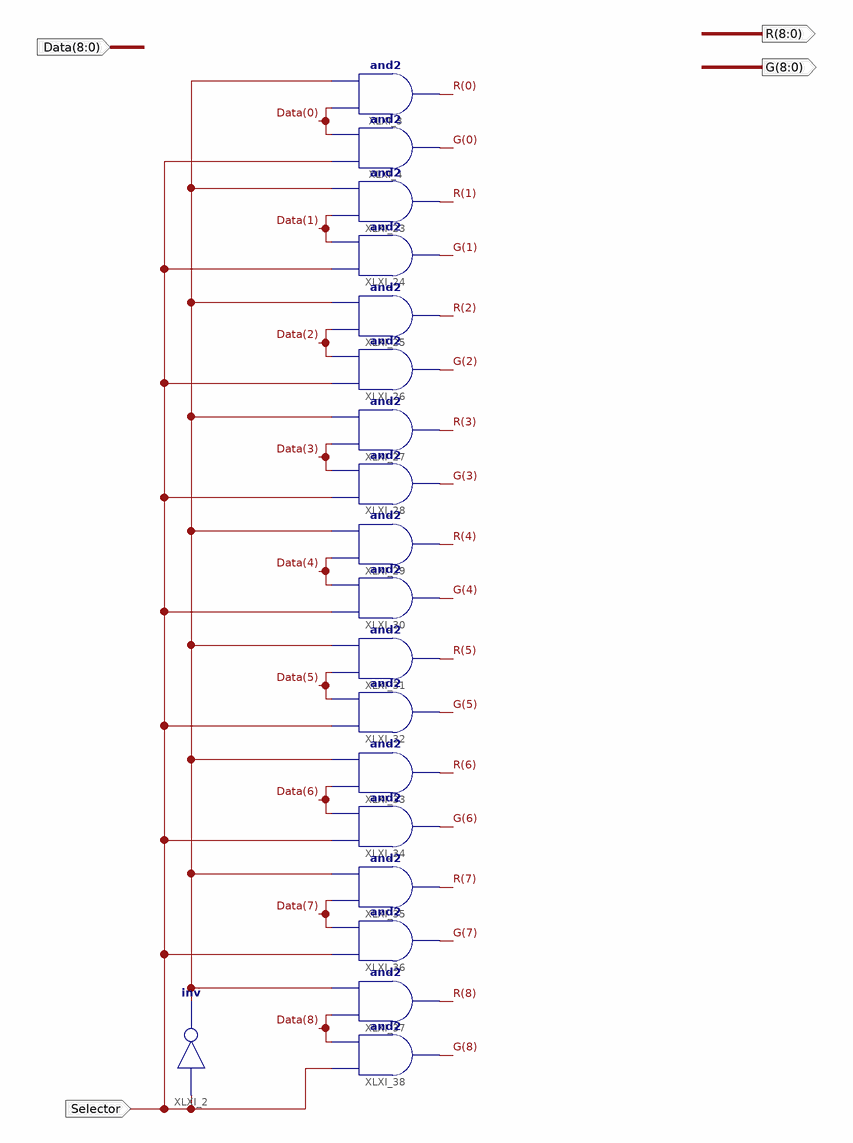
[diagram p0: schematic sheet 1]
// Xilinx ISE schematic colorNow.sch (spartan6) as structural Verilog: 19 symbols, 4 ports
module colorNow (
  input  [8:0] Data,
  input  Selector,
  output [8:0] R,
  output [8:0] G
);

  wire XLXN_6;

  not XLXI_2 (XLXN_6, Selector);
  and XLXI_3 (R[0], Data[0], XLXN_6);
  and XLXI_4 (G[0], Selector, Data[0]);
  and XLXI_23 (R[1], Data[1], XLXN_6);
  and XLXI_24 (G[1], Selector, Data[1]);
  and XLXI_25 (R[2], Data[2], XLXN_6);
  and XLXI_26 (G[2], Selector, Data[2]);
  and XLXI_27 (R[3], Data[3], XLXN_6);
  and XLXI_28 (G[3], Selector, Data[3]);
  and XLXI_29 (R[4], Data[4], XLXN_6);
  and XLXI_30 (G[4], Selector, Data[4]);
  and XLXI_31 (R[5], Data[5], XLXN_6);
  and XLXI_32 (G[5], Selector, Data[5]);
  and XLXI_33 (R[6], Data[6], XLXN_6);
  and XLXI_34 (G[6], Selector, Data[6]);
  and XLXI_35 (R[7], Data[7], XLXN_6);
  and XLXI_36 (G[7], Selector, Data[7]);
  and XLXI_37 (R[8], Data[8], XLXN_6);
  and XLXI_38 (G[8], Selector, Data[8]);
endmodule
